# EAGLE schematic Platine_Diplomarbeit (EAGLE 9.6.2)
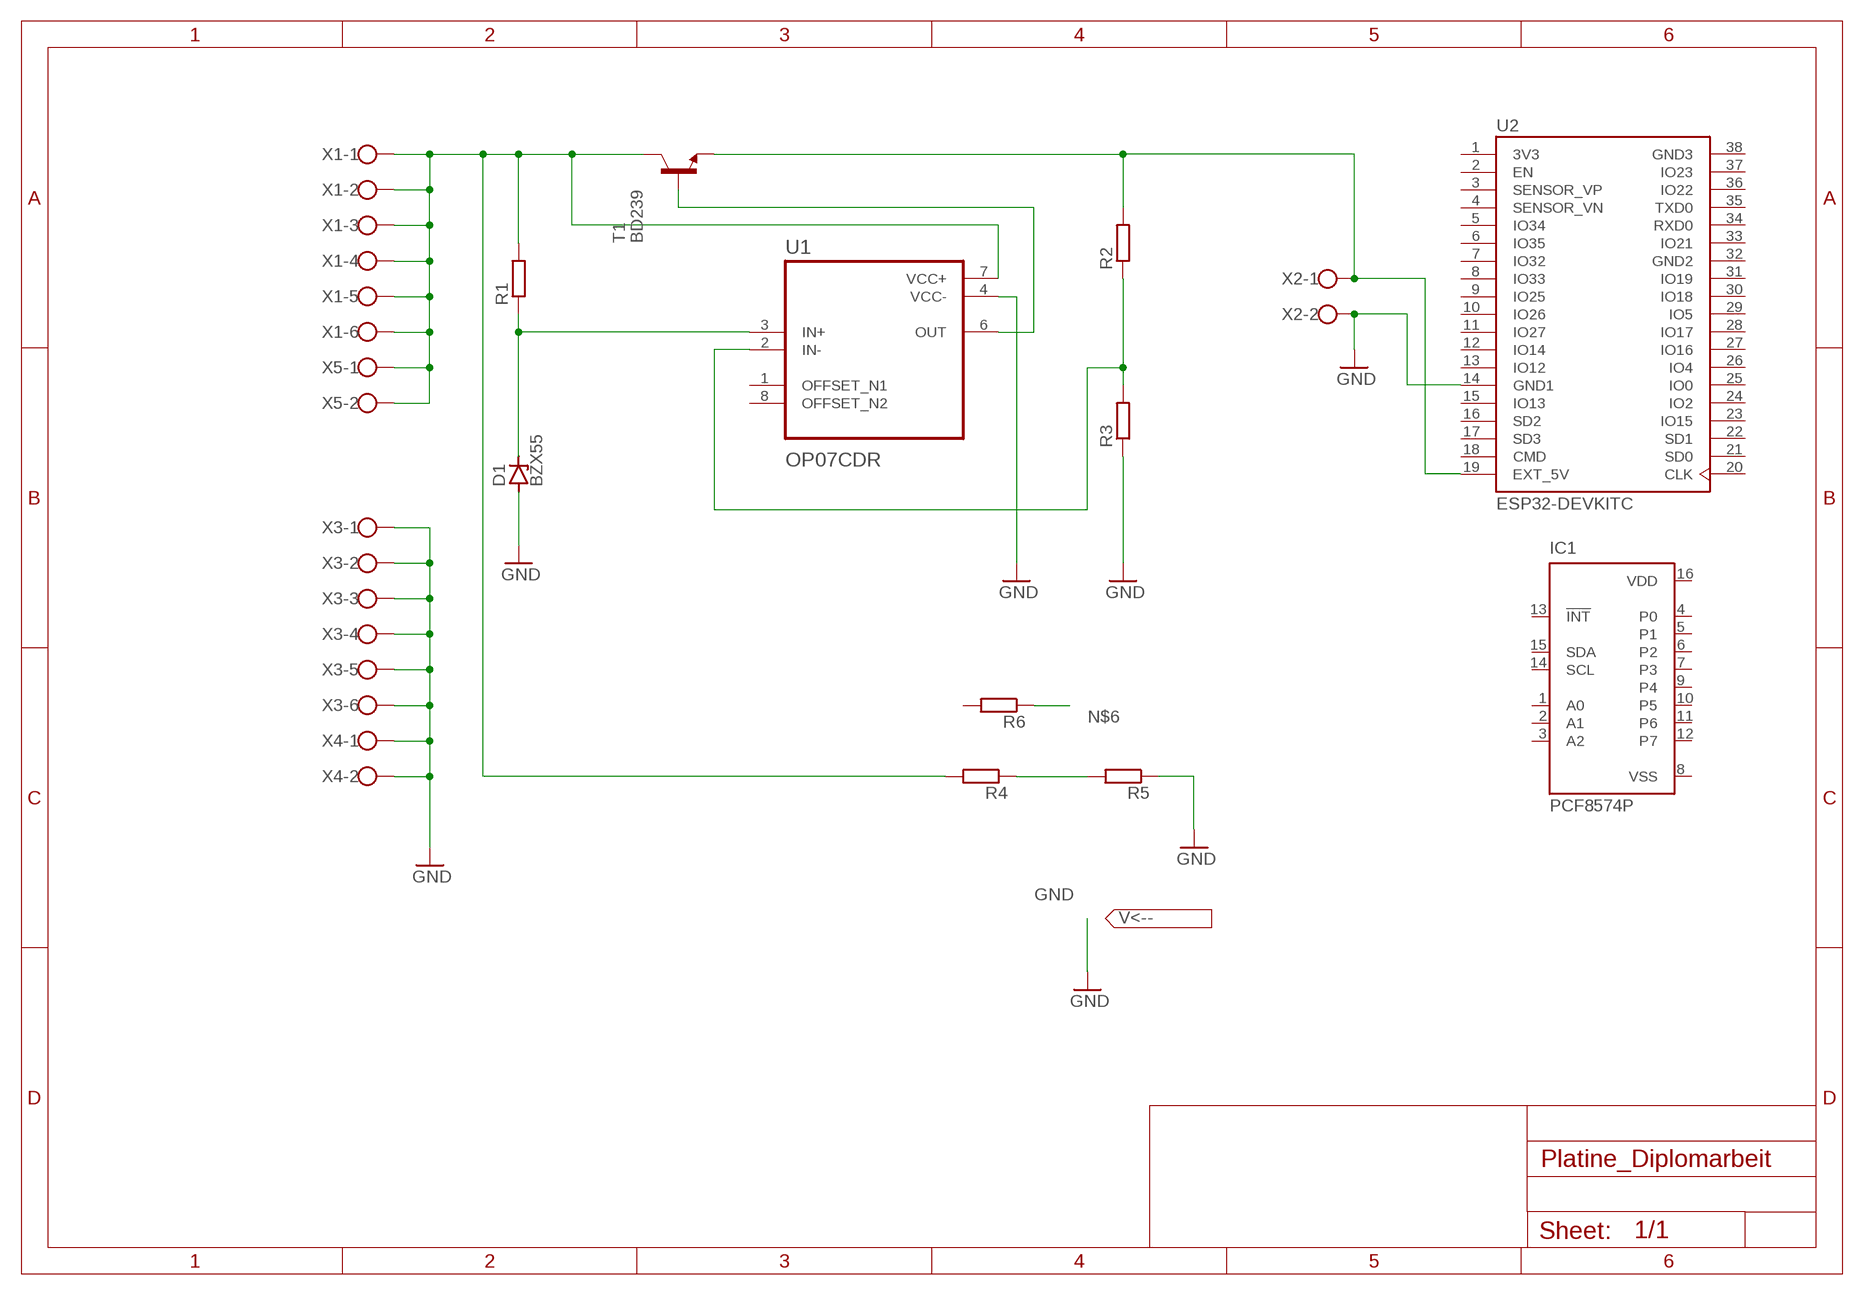
[diagram p0: schematic, sheet 1]

## Parts
D1  BZX55  [DO35Z10]
IC1  PCF8574P  [DIL16]
R1  R-EU_0309/12  [0309/12]
R2  R-EU_0309/12  [0309/12]
R3  R-EU_0309/12  [0309/12]
R4  R-EU_0309/12  [0309/12]
R5  R-EU_0309/12  [0309/12]
R6  R-EU_0309/12  [0309/12]
T1  BD239  [TO220]
U1  OP07CDR  [SOIC127P599X175-8N]
U2  ESP32-DEVKITC  [MODULE_ESP32-DEVKITC]
X1  W237-6  [W237-6]
X2  W237-102  [W237-102]
X3  W237-6  [W237-6]
X4  W237-102  [W237-102]
X5  W237-102  [W237-102]

## Nets
GND: D1.A R3.1 R5.1 U1.4(VCC-) U2.14(GND1) X2.2 X3.1 X3.2 X3.3 X3.4 X3.5 X3.6 X4.1 X4.2
GND1: R1.2 R4.2 T1.2(C) U1.7(VCC+) X1.1 X1.2 X1.3 X1.4 X1.5 X1.6 X5.1 X5.2
N$1: D1.C R1.1 U1.3(IN+)
N$2: R4.1 R5.2
N$3: R2.2 T1.3(E) U2.19(EXT_5V) X2.1
N$4: R2.1 R3.2 U1.2(IN-)
N$5: T1.1(B) U1.6(OUT)
N$6: R6.1
Unconnected: IC1.1(A0) IC1.2(A1) IC1.3(A2) IC1.4(P0) IC1.5(P1) IC1.6(P2) IC1.7(P3) IC1.9(P4) IC1.10(P5) IC1.11(P6) IC1.12(P7) IC1.13(!INT) IC1.14(SCL) IC1.15(SDA) R6.2 U1.1(OFFSET_N1) U1.8(OFFSET_N2) U2.2(EN) U2.3(SENSOR_VP) U2.4(SENSOR_VN) U2.5(IO34) U2.6(IO35) U2.7(IO32) U2.8(IO33) U2.9(IO25) U2.10(IO26) U2.11(IO27) U2.12(IO14) U2.13(IO12) U2.15(IO13) U2.16(SD2) U2.17(SD3) U2.18(CMD) U2.20(CLK) U2.21(SD0) U2.22(SD1) U2.23(IO15) U2.24(IO2) U2.25(IO0) U2.26(IO4) U2.27(IO16) U2.28(IO17) U2.29(IO5) U2.30(IO18) U2.31(IO19) U2.33(IO21) U2.34(RXD0) U2.35(TXD0) U2.36(IO22) U2.37(IO23)

## Power pins joined to a net without a drawn wire
3V3: U2.1(3V3)
GND2: U2.32(GND2)
GND3: U2.38(GND3)
VDD: IC1.16(VDD)
VSS: IC1.8(VSS)

## Library data of the parts
D1 = diode:BZX55: Z DIODE
IC1 = micro-philips:PCF8574: I2C-Bus Remote 8-bit I/O expander http://www.semiconductors.philips.com/acrobat_download/datasheets/PCF8574_4.pdf; MPN: PCF8574PN; OC_FARNELL: 204020; OC_NEWARK: 11N8515
R1-R6 = rcl:R-EU_: RESISTOR, European symbol; SPICEPREFIX: R
T1 = transistor:BD239: NPN TRANSISTOR Source: http://www.fairchildsemi.com/ds/BD/BD239C.pdf
U1 = OP07CDR:OP07CDR: Check availability <https://pricing.snapeda.com/parts/OP07CDR/Texas%20Instruments/view-part?ref=eda>; AVAILABILITY: In Stock; CHECK_PRICES: https://www.snapeda.com/parts/OP07CDR/Texas+Instruments/view-part/?ref=eda; DESCRIPTION: Low-offset voltage (0.25 mV) single operational amplifier; MF: Texas Instruments; MP: OP07CDR; PACKAGE: SOIC-8 Texas Instruments; PRICE: None; PURCHASE-URL: https://www.snapeda.com/api/url_track_click_mouser/?unipart_id=435734&manufacturer=Texas Instruments&part_name=OP07CDR&search_term=None; SNAPEDA_LINK: https://www.snapeda.com/parts/OP07CDR/Texas+Instruments/view-part/?ref=snap
U2 = ESP32-DEVKITC:ESP32-DEVKITC: ESP32-DEVKITC Check availability <https://pricing.snapeda.com/parts/ESP32-DEVKITC/Olimex%20LTD/view-part?ref=eda>; AVAILABILITY: In Stock; DESCRIPTION: - ESP32-WROOM32 Transceiver; 802.11 b/g/n (Wi-Fi, WiFi, WLAN), Bluetooth® Smart 4.x Low Energy (BLE) 2.4GHz Evaluation Board; MF: Olimex LTD; MP: ESP32-DEVKITC; PACKAGE: None; PRICE: None; PURCHASE-URL: https://pricing.snapeda.com/search/part/ESP32-DEVKITC/?ref=eda
X1 X3 = con-wago-500:W237-6: WAGO SCREW CLAMP; OC_FARNELL: unknown; OC_NEWARK: unknown
X2 X4 X5 = con-wago-500:W237-102: WAGO SCREW CLAMP; MPN: 237-102; OC_FARNELL: unknown; OC_NEWARK: 70K9898